# Altium project DAPLinkTiny.PrjPCB
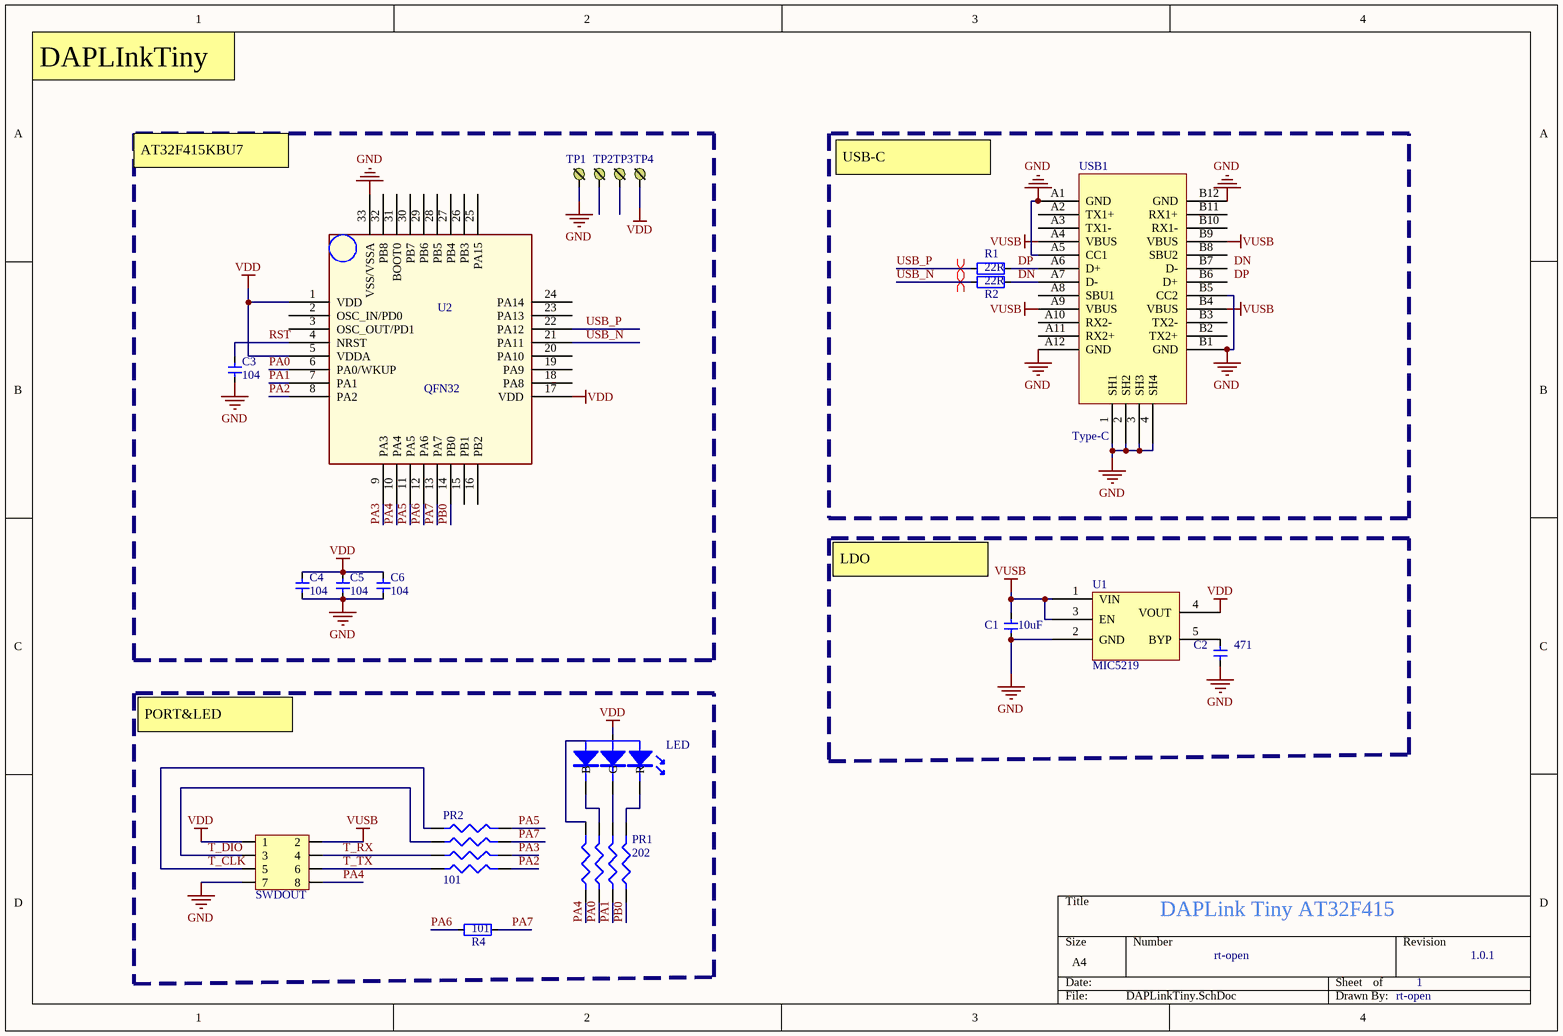
[diagram p0: DAPLinkTiny.SchDoc]
1 sheet, 20 parts. Net scope: global (net labels, ports and power ports of the same name join across sheets).
Board file: DAPLinkTiny.PcbDoc

## Sheet DAPLinkTiny.SchDoc: DAPLink Tiny AT32F415
size A4; Author: rt-open; CompanyName: rt-open; DrawnBy: rt-open; Engineer: rt-open; Organization: rt-open; Revision: 1.0.1; SheetNumber: 1; SheetTotal: 1; Version: 1.0; LibVersion: 2.5

### Parts
C1  value 10uF  [CAP_0603]  (hidden comment: Cap_0603)
C2  value 471  [CAP_0603]  (hidden comment: Cap_0603)
C3  value 104  [CAP_0603]  (hidden comment: Cap_0603)
C4  value 104  [CAP_0603]  (hidden comment: Cap_0603)
C5  value 104  [CAP_0603]  (hidden comment: Cap_0603)
C6  value 104  [CAP_0603]  (hidden comment: Cap_0603)
LED  LTST-C19HE1WT  [LTST-C19HE1WT]  (value not drawn)
PR1  202  [RES4B]
PR2  101  [RES4B]
R1  value 22R  [RES_0603]  (hidden comment: Res_0603)
R2  value 22R  [RES_0603]  (hidden comment: Res_0603)
R4  value 101  [RES_0603]  (hidden comment: Res_0603)
SWDOUT  HDR2x4_2.54  [HDR2X4_2.54_180H]  (value not drawn)
TP1  PLUG  [SMT_PAD_ROUND]  (value not drawn)
TP2  PLUG  [SMT_PAD_ROUND]  (value not drawn)
TP3  PLUG  [SMT_PAD_ROUND]  (value not drawn)
TP4  PLUG  [SMT_PAD_ROUND]  (value not drawn)
U1  MIC5219  [SOT23-5]
U2  QFN32
USB1  Type-C  [Type-C]

### Nets
GND: C1.1 C2.1 C3.1 C4.1 C5.1 C6.1 SWDOUT.7 TP1.1 U1.2(GND) U2.33(VSS/VSSA) USB1.1(SH1) USB1.2(SH2) USB1.3(SH3) USB1.4(SH4) USB1.A1(GND) USB1.A5(CC1) USB1.A12(GND) USB1.B1(GND) USB1.B5(CC2) USB1.B12(GND)
VDD: C4.2 C5.2 C6.2 LED.4(A) SWDOUT.1 TP4.1 U1.4(VOUT) U2.1(VDD) U2.5(VDDA) U2.17(VDD)
VUSB: C1.2 SWDOUT.2 U1.1(VIN) U1.3(EN) USB1.A4(VBUS) USB1.A9(VBUS) USB1.B4(VBUS) USB1.B9(VBUS)
DN: R2.2 USB1.A7(D-)
DP: R1.2 USB1.A6(D+)
PA0: PR1.3(R2) U2.6(PA0/WKUP)
PA1: PR1.5(R3) U2.7(PA1)
PA2: PR2.8(R0) U2.8(PA2)
PA3: PR2.6(R2) U2.9(PA3)
PA4: PR1.1(R0) SWDOUT.8 U2.10(PA4)
PA5: PR2.2(R1) U2.11(PA5)
PA6: R4.1 U2.12(PA6)
PA7: PR2.4(R3) R4.2 U2.13(PA7)
PB0: PR1.7(R1) U2.14(PB0)
RST: C3.2 U2.4(NRST)
T_CLK: PR2.1(R0) SWDOUT.5
T_DIO: PR2.3(R2) SWDOUT.3
T_RX: PR2.5(R3) SWDOUT.4
T_TX: PR2.7(R1) SWDOUT.6
USB_N: R2.1 U2.21(PA11)
USB_P: R1.1 U2.22(PA12)
NetC2_2: C2.2 U1.5(BYP)
NetLED_1: LED.1(R) PR1.8(R0)
NetLED_2: LED.2(G) PR1.6(R2)
NetLED_3: LED.3(B) PR1.4(R3)

Not connected (* = marked no-connect by the designer): PR1 2(R1); TP2 1; TP3 1; U2 2(OSC_IN/PD0) 3(OSC_OUT/PD1) 15(PB1) 16(PB2) 18(PA8) 19(PA9) 20(PA10) 23(PA13) 24(PA14) 25(PA15) 26(PB3) 27(PB4) 28(PB5) 29(PB6) 30(PB7) 31(BOOT0) 32(PB8); USB1 A2(TX1+) A3(TX1-) A8(SBU1) A10(RX2-) A11(RX2+) B2(TX2+) B3(TX2-) B6(D+) B7(D-) B8(SBU2) B10(RX1-) B11(RX1+)

### Layout directives
differential pair: USB_N, USB_P

### Notes on the sheet
- DAPLInkTiny
- AT32F415KBU7
- USB-C
- (near C1) LDO
- PORT&LED
- Labels drawn without touching a wire or pin: DN, DP
- Title
- Size:
- Date:
- A4
- Number:
- Time:
- Revision:
- Sheet
- of
- File:

### Library data of the parts
C1 = Cap_0603: 10uF
C2-C6 = Cap_0603: Capacitor
LED = RGB_LED_5MM
PR1 PR2 = RES4B
R1 R2 R4 = Res_0603: Resistor
SWDOUT = HDR2x4_2.54: Header